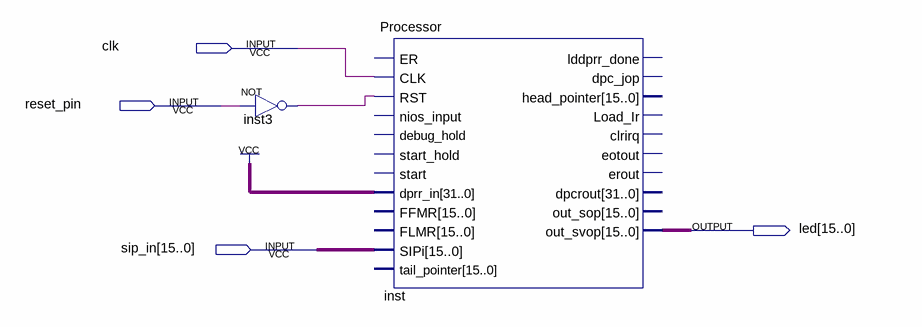
[diagram p0: schematic sheet]
// Quartus schematic deployed_project.bdf as structural Verilog: 2 symbols, 4 pins
module deployed_project (
  input  clk,
  input  reset_pin,
  input  [15:0] sip_in,
  output [15:0] led
);

  wire inst3_out;

  not inst3 (inst3_out, reset_pin);
  Processor inst (
    .CLK(clk), .RST(inst3_out), .dprr_in({32{1'b1}}), .SIPi(sip_in), .out_svop(led));  // open: ER, nios_input, debug_hold, start_hold, start, FFMR, FLMR, tail_pointer, dpc_jop, Load_Ir, eotout, erout, dpcrout, out_sop, lddprr_done, head_pointer, clrirq
endmodule
